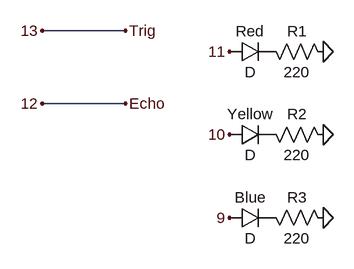
[diagram p0: schematic VienSetUp.asc]
VienSetUp.asc, the LTspice schematic file:
Version 4
SHEET 1 880 680
WIRE 48 -16 -80 -16
WIRE 48 96 -80 96
FLAG 352 16 0
FLAG 352 144 0
FLAG 352 272 0
FLAG 208 16 11
FLAG 208 144 10
FLAG 208 272 9
FLAG -80 -16 13
FLAG -80 96 12
FLAG 48 -16 Trig
FLAG 48 96 Echo
SYMBOL diode 208 32 R270
WINDOW 0 32 32 VTop 2
WINDOW 3 0 32 VBottom 2
SYMATTR InstName Red
SYMBOL diode 208 160 R270
WINDOW 0 32 32 VTop 2
WINDOW 3 0 32 VBottom 2
SYMATTR InstName Yellow
SYMBOL diode 208 288 R270
WINDOW 0 32 32 VTop 2
WINDOW 3 0 32 VBottom 2
SYMATTR InstName Blue
SYMBOL res 256 0 M90
WINDOW 0 0 56 VBottom 2
WINDOW 3 32 56 VTop 2
SYMATTR InstName R1
SYMATTR Value 220
SYMBOL res 256 128 M90
WINDOW 0 0 56 VBottom 2
WINDOW 3 32 56 VTop 2
SYMATTR InstName R2
SYMATTR Value 220
SYMBOL res 256 256 M90
WINDOW 0 0 56 VBottom 2
WINDOW 3 32 56 VTop 2
SYMATTR InstName R3
SYMATTR Value 220

The netlist it stands for:
* VienSetUp.asc
D§Red 11 P001 D
D§Yellow 10 P002 D
D§Blue 9 P003 D
R1 P001 0 220
R2 P002 0 220
R3 P003 0 220
.model D D
.lib standard.dio
.backanno
.end